# Altium project HAB-Altitude-Dynamics-Control-Card.PrjPcb (part 1 of 4)
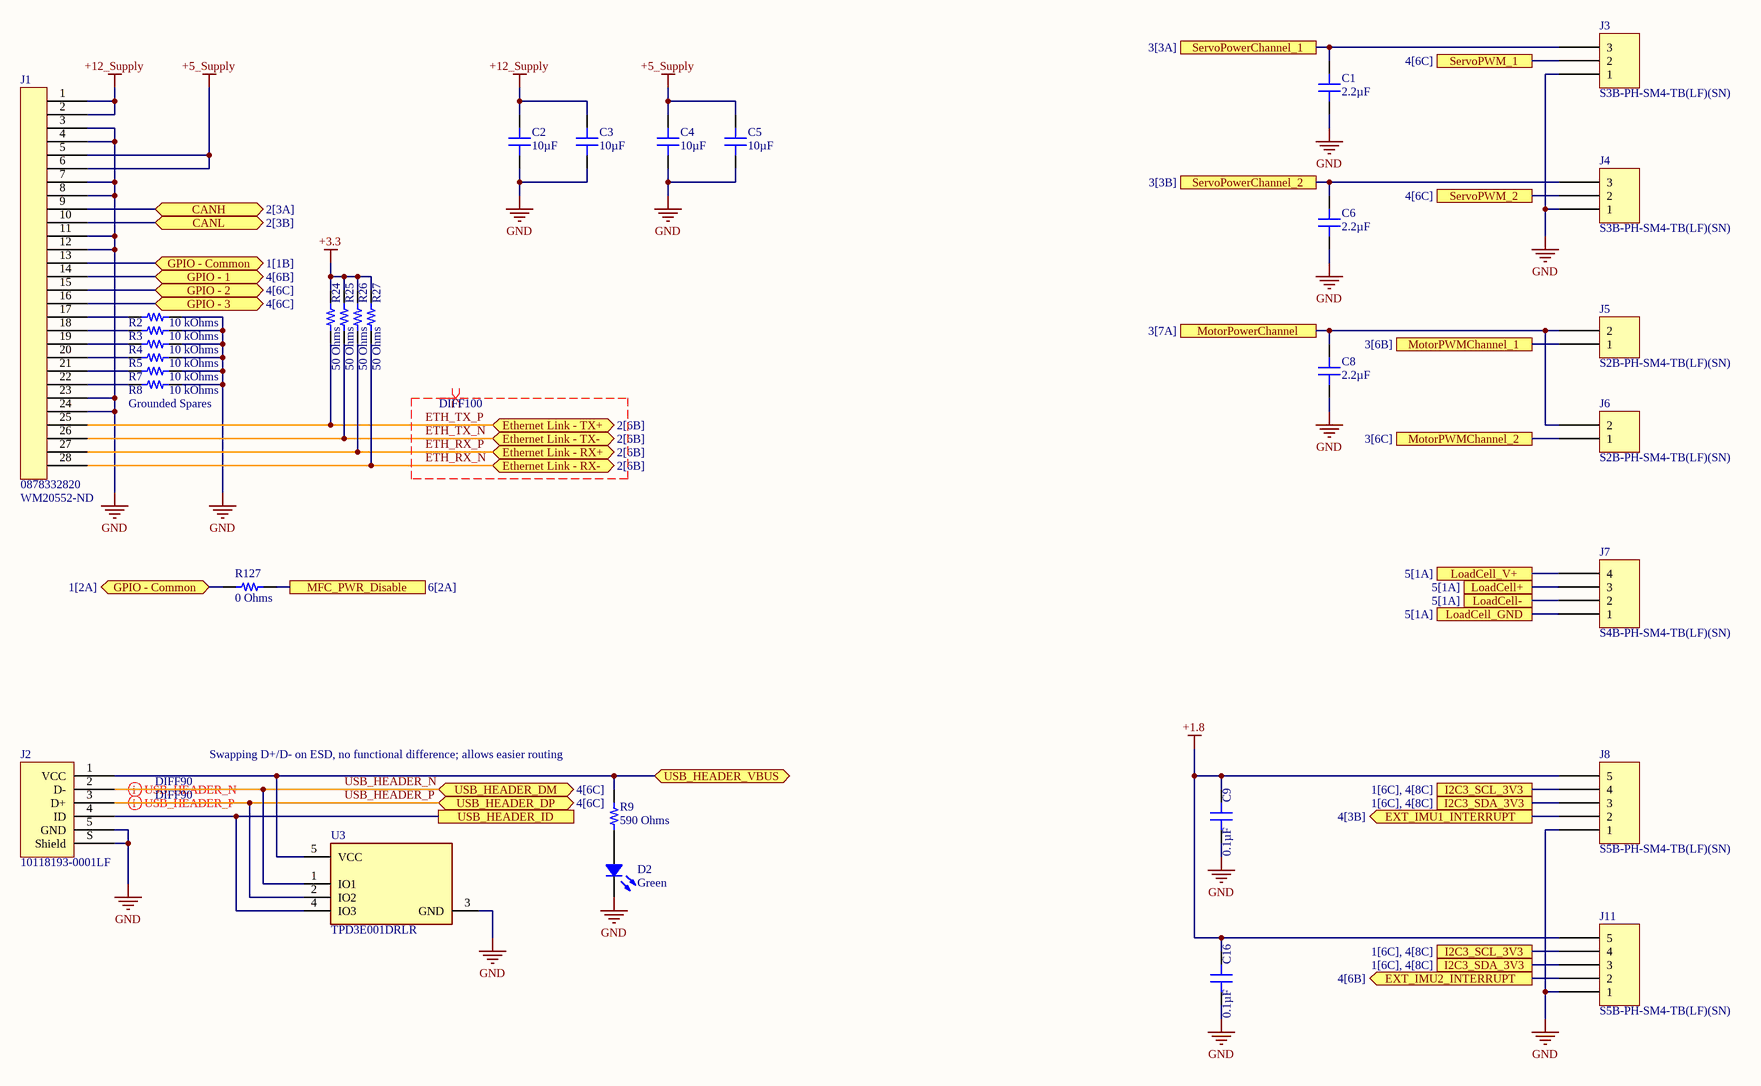
[diagram p0: Interfaces.SchDoc]
7 sheets, 279 parts. Net scope: flat (ports and power ports of the same name join across sheets).
Board file: AltitudeDynamicsControlBoard.PcbDoc
Sheets:
  Interfaces.SchDoc
  Transceivers.SchDoc
  Controllers.SchDoc
  Microcontroller.SchDoc
  Sensors.SchDoc
  Power-Supplies.SchDoc
  12V-Power-Supplies.SchDoc

## Sheet Interfaces.SchDoc: Payload Card Interfaces
size A3; Revision: 1A; SheetNumber: 1; SheetTotal: 7; Organization: Brickworks; Address1: Matthew Glazer; Address2: Design Engineer

### Parts
C1  2.2µF  [CAP 0603_1608]
C2  10µF  [CAP 0805_2012]
C3  10µF  [CAP 0805_2012]
C4  10µF  [CAP 0805_2012]
C5  10µF  [CAP 0805_2012]
C6  2.2µF  [CAP 0603_1608]
C8  2.2µF  [CAP 0603_1608]
C9  0.1µF  [CAP 0603_1608]
C16  0.1µF  [CAP 0603_1608]
D2  Green  [LED 0603_1608 GREEN]
J1  0878332820  Supplier Part Number 1: WM20552-ND  [0878332820]
J2  10118193-0001LF  [FCI USB 10118193-0001LF]
J3  S3B-PH-SM4-TB(LF)(SN)  [JST S3B-PH-SM4-TB]
J4  S3B-PH-SM4-TB(LF)(SN)  [JST S3B-PH-SM4-TB]
J5  S2B-PH-SM4-TB(LF)(SN)  [JST S2B-PH-SM4-TB]
J6  S2B-PH-SM4-TB(LF)(SN)  [JST S2B-PH-SM4-TB]
J7  S4B-PH-SM4-TB(LF)(SN)  [JST S4B-PH-SM4-TB]
J8  S5B-PH-SM4-TB(LF)(SN)  [JST S5B-PH-SM4-TB]
J11  S5B-PH-SM4-TB(LF)(SN)  [JST S5B-PH-SM4-TB]
R2  10 kOhms  [RES 0603_1608]
R3  10 kOhms  [RES 0603_1608]
R4  10 kOhms  [RES 0603_1608]
R5  10 kOhms  [RES 0603_1608]
R7  10 kOhms  [RES 0603_1608]
R8  10 kOhms  [RES 0603_1608]
R9  590 Ohms  [RES 0603_1608]
R24  50 Ohms  [RES 0603_1608]
R25  50 Ohms  [RES 0603_1608]
R26  50 Ohms  [RES 0603_1608]
R27  50 Ohms  [RES 0603_1608]
R127  0 Ohms  [RES 0603_1608]
U3  TPD3E001DRLR  [FP-DRL0005A-MFG]

### Ports
CANH (bidir, see 2[3A]), CANL (bidir, see 2[3B]), Ethernet Link - RX+ (bidir, see 2[6B]), Ethernet Link - RX- (bidir, see 2[6B]), Ethernet Link - TX+ (bidir, see 2[6B]), Ethernet Link - TX- (bidir, see 2[6B]), EXT_IMU1_INTERRUPT (out, see 4[3B]), EXT_IMU2_INTERRUPT (out, see 4[6B]), GPIO - 1 (bidir, see 4[6B]), GPIO - 2 (bidir, see 4[6C]), GPIO - 3 (bidir, see 4[6C]), GPIO - Common (bidir, see 1[1B]), GPIO - Common (bidir, see 1[2A]), I2C3_SCL_3V3 (see 1[6C], 4[8C]), I2C3_SDA_3V3 (see 1[6C], 4[8C]), LoadCell+ (see 5[1A]), LoadCell- (see 5[1A]), LoadCell_GND (see 5[1A]), LoadCell_V+ (see 5[1A]), MFC_PWR_Disable (see 6[2A]), MotorPowerChannel (see 3[7A]), MotorPWMChannel_1 (see 3[6B]), MotorPWMChannel_2 (see 3[6C]), ServoPowerChannel_1 (see 3[3A]), ServoPowerChannel_2 (see 3[3B]), ServoPWM_1 (see 4[6C]), ServoPWM_2 (see 4[6C]), USB_HEADER_DM (bidir, see 4[6C]), USB_HEADER_DP (bidir, see 4[6C]), USB_HEADER_ID, USB_HEADER_VBUS (bidir)

### Nets
+1.8: C9.2 C16.2 J8.5 J11.5
+3.3: J7.4 R24.2 R25.2 R26.2 R27.2 ; port LoadCell_V+
+5_Supply: C4.2 C5.2 J1.5 J1.6
+12_Supply: C2.2 C3.2 J1.1 J1.2
GND: C1.1 C2.1 C3.1 C4.1 C5.1 C6.1 C8.1 C9.1 C16.1 D2.2 J1.3 J1.4 J1.7 J1.8 J1.11 J1.12 J1.23 J1.24 J2.5(GND) J2.S(Shield) J3.1 J4.1 J8.1 J11.1 R2.2 R3.2 R4.2 R5.2 R7.2 R8.2 U3.3(GND)
ETH_RX_N: J1.28 R27.1 ; port Ethernet Link - RX-
ETH_RX_P: J1.27 R26.1 ; port Ethernet Link - RX+
ETH_TX_N: J1.26 R25.1 ; port Ethernet Link - TX-
ETH_TX_P: J1.25 R24.1 ; port Ethernet Link - TX+
USB_HEADER_N: J2.2(D-) U3.1(IO1) ; port USB_HEADER_DM
USB_HEADER_P: J2.3(D+) U3.2(IO2) ; port USB_HEADER_DP
NetC1_2: C1.2 J3.3 ; port ServoPowerChannel_1
NetC6_2: C6.2 J4.3 ; port ServoPowerChannel_2
NetC8_2: C8.2 J5.2 J6.2 ; port MotorPowerChannel
NetD1_1: R127.2 ; port MFC_PWR_Disable
NetD2_1: D2.1 R9.1
NetD4_1: J1.10 ; port CANL
NetD4_2: J1.9 ; port CANH
NetJ1_13: J1.13 R127.1 ; port GPIO - Common
NetJ1_14: J1.14 ; port GPIO - 1
NetJ1_15: J1.15 ; port GPIO - 2
NetJ1_16: J1.16 ; port GPIO - 3
NetJ1_17: J1.17 R2.1
NetJ1_18: J1.18 R3.1
NetJ1_19: J1.19 R4.1
NetJ1_20: J1.20 R5.1
NetJ1_21: J1.21 R7.1
NetJ1_22: J1.22 R8.1
NetJ2_1: J2.1(VCC) R9.2 U3.5(VCC) ; port USB_HEADER_VBUS
NetJ2_4: J2.4(ID) U3.4(IO3) ; port USB_HEADER_ID
NetJ3_2: J3.2 ; port ServoPWM_1
NetJ4_2: J4.2 ; port ServoPWM_2
NetJ5_1: J5.1 ; port MotorPWMChannel_1
NetJ6_1: J6.1 ; port MotorPWMChannel_2
NetJ7_1: J7.1 ; port LoadCell_GND
NetJ7_2: J7.2 ; port LoadCell-
NetJ7_3: J7.3 ; port LoadCell+
NetJ8_2: J8.2 ; port EXT_IMU1_INTERRUPT
NetJ8_3: J8.3 J11.3 ; port I2C3_SDA_3V3
NetJ8_4: J8.4 J11.4 ; port I2C3_SCL_3V3
NetJ11_2: J11.2 ; port EXT_IMU2_INTERRUPT

### Layout directives
differential pair; differential pair class DIFF90: USB_HEADER_N, USB_HEADER_P
differential pair; differential pair class DIFF100: ETH_RX_N, ETH_RX_P, ETH_TX_N, ETH_TX_P

### Notes on the sheet
- (near R8) Grounded Spares
- (near R9) Swapping D+/D- on ESD, no functional difference; allows easier routing
- Title
- Size:
- Date:
- A3
- Number:
- Time:
- Revision:
- Sheet
- of
- File:

### Library data of the parts
C1 C6 C8 = EMK107BJ225KA-T: CAP CER 2.2UF 16V X5R 0603; Manufacturer: Taiyo Yuden; Tolerance: ±10%; Part Number: EMK107BJ225KA-T; Value: 2.2µF; Applications: General Purpose; Capacitance: 2.2µF; ComponentLink1Description: Datasheet; ComponentLink1URL: https://ds.yuden.co.jp/TYCOMPAS/ut/detail?pn=EMK107BJ225KA-T  &u=M; ComponentLink2Description: DigiKey Link; ComponentLink2URL: http://digikey.com/product-detail/en/taiyo-yuden/EMK107BJ225KA-T/587-1430-1-ND/1004061; Device Package: 0603 (1608 Metric); LastUpdated: 9/2/2020 1:03:30 AM; Lifecycle Status: Active; Minimum Order: 1; Mounting Type: Surface Mount, MLCC; Operating Temperature: -55°C ~ 85°C; Package / Case: 0603 (1608 Metric); Packaging: TapeAndReel; PartId: 5619; Part Status: Active; Price: 0.02; Series: M; Size / Dimension: 0.063" L x 0.031" W (1.60mm x 0.80mm); Supplier 1: DigiKey; Supplier Part Number 1: 587-1430-1-ND; Temperature Coefficient: X5R; Thickness (Max): 0.035" (0.90mm); Voltage - Rated: 16V
C2-C5 = CC0805KKX5R7BB106: CAP CER 10UF 16V X5R 0805; Manufacturer: Yageo; Tolerance: ±10%; Part Number: CC0805KKX5R7BB106; Value: 10µF; Applications: General Purpose; Capacitance: 10µF; ComponentLink1Description: Datasheet; ComponentLink1URL: https://www.yageo.com/upload/media/product/productsearch/datasheet/mlcc/UPY-GPHC_X5R_4V-to-50V_25.pdf; ComponentLink2Description: DigiKey Link; ComponentLink2URL: http://digikey.com/product-detail/en/yageo/CC0805KKX5R7BB106/311-1865-1-ND/5195767; Device Package: 0805 (2012 Metric); LastUpdated: 9/2/2020 1:04:30 AM; Lifecycle Status: Active; Minimum Order: 1; Mounting Type: Surface Mount, MLCC; Operating Temperature: -55°C ~ 85°C; Package / Case: 0805 (2012 Metric); Packaging: TapeAndReel; PartId: 8867; Part Status: Active; Price: 0.09; Series: CC; Size / Dimension: 0.079" L x 0.049" W (2.00mm x 1.25mm); Supplier 1: DigiKey; Supplier Part Number 1: 311-1865-1-ND; Temperature Coefficient: X5R; Thickness (Max): 0.057" (1.45mm); Voltage - Rated: 16V
C9 C16 = CL10B104KA8WPNC: CAP CER 0.1UF 25V X7R 0603; Manufacturer: Samsung Electro-Mechanics; Tolerance: ±10%; Part Number: CL10B104KA8WPNC; Value: 0.1µF; Applications: Automotive; Capacitance: 0.1µF; ComponentLink1Description: Datasheet; ComponentLink1URL: http://www.samsungsem.com/kr/support/product-search/mlcc/CL10B104KA8WPNC.jsp; ComponentLink2Description: DigiKey Link; ComponentLink2URL: http://digikey.com/product-detail/en/samsung-electro-mechanics/CL10B104KA8WPNC/1276-6717-1-ND/5961576; Device Package: 0603 (1608 Metric); Features: Open Mode; LastUpdated: 9/2/2020 1:03:30 AM; Lifecycle Status: Active; Minimum Order: 1; Mounting Type: Surface Mount, MLCC; Operating Temperature: -55°C ~ 125°C; Package / Case: 0603 (1608 Metric); Packaging: TapeAndReel; PartId: 5631; Part Status: Active; Price: 0.02; Ratings: AEC-Q200; Series: CL; Size / Dimension: 0.063" L x 0.031" W (1.60mm x 0.80mm); Supplier 1: DigiKey; Supplier Part Number 1: 1276-6717-1-ND; Temperature Coefficient: X7R; Thickness (Max): 0.035" (0.90mm); Voltage - Rated: 25V
D2 = LTST-C193KGKT-5A: LED GREEN CLEAR CHIP SMD; Manufacturer: Lite-On Inc.; Configuration: Standard; Current - Test: 5mA; Lens Color: Colorless; Lens Size: 1.15mm x 0.80mm; Lens Style: Rectangle with Flat Top; Millicandela Rating: 16.25mcd; Viewing Angle: 130°; Voltage - Forward (Vf) (Typ): 2V; Wavelength - Dominant: 572nm; Wavelength - Peak: 574nm; Part Number: LTST-C193KGKT-5A; Color: Green; ComponentLink1Description: Datasheet; ComponentLink1URL: http://optoelectronics.liteon.com/upload/download/DS22-2007-0094/LTST-C193KGKT-5A.PDF; ComponentLink2Description: DigiKey Link; ComponentLink2URL: http://digikey.com/product-detail/en/lite-on-inc/LTST-C193KGKT-5A/160-1828-1-ND/2356247; Device Package: 0603 (1608 Metric); Height (Max): 0.45mm; LastUpdated: 9/2/2020 1:20:41 AM; Lens Transparency: Clear; Lifecycle Status: Active; Minimum Order: 1; Mounting Type: Surface Mount; Package / Case: 0603 (1608 Metric); Packaging: TapeAndReel; PartId: 694; Part Status: Active; Price: 0.06; Series: -; Size / Dimension: 1.60mm L x 0.80mm W; Supplier 1: DigiKey; Supplier Part Number 1: 160-1828-1-ND; Supplier Device Package: Chip LED; Value: Green
J2 = 10118193-0001LF: CONN RCPT USB2.0 MICRO B SMD R/A; Manufacturer: Amphenol ICC (FCI); Connector Type: USB - micro B; Current Rating (Amps): 1.8A per Contact; Gender: Receptacle; Mating Cycles: 10000; Number of Contacts: 5; Number of Ports: 1; Shielding: Shielded; Voltage - Rated: 100VAC; Part Number: 10118193-0001LF; ComponentLink1Description: Datasheet; ComponentLink1URL: https://cdn.amphenol-icc.com/media/wysiwyg/files/documentation/datasheet/inputoutput/io_usb_micro.pdf; ComponentLink2Description: DigiKey Link; ComponentLink2URL: //digikey.com/product-detail/en/amphenol-icc-fci/10118193-0001LF/609-4616-2-ND/2785388; Features: Solder Retention; LastUpdated: 12/9/2019 8:51:28 PM; Lifecycle Status: 0; Minimum Order: 1; Mounting Feature: Horizontal; Mounting Type: Surface Mount, Right Angle; Through Hole; Operating Temperature: -30°C ~ 80°C; Packaging: TapeAndReel; Part Status: Active; Price: 0.21; Series: -; Specifications: USB 2.0; Supplier 1: DigiKey; Supplier Part Number 1: 609-4616-2-ND; Termination: Solder
J3 J4 = S3B-PH-SM4-TB(LF)(SN): CONN HEADER SMD R/A 3POS 2MM; Manufacturer: JST Sales America Inc.; Contact Length - Mating: 0.130" (3.30mm); Current Rating (Amps): 2A; Material Flammability Rating: UL94 V-0; Number of Positions: 3; Number of Positions Loaded: All; Pitch - Mating: 0.079" (2.00mm); Shrouding: Shrouded - 4 Wall; Style: Board to Cable/Wire; Voltage Rating: 100V; Part Number: S3B-PH-SM4-TB(LF)(SN); ComponentLink1Description: Datasheet; ComponentLink1URL: http://www.jst-mfg.com/product/pdf/eng/ePH.pdf; ComponentLink2Description: DigiKey Link; ComponentLink2URL: http://digikey.com/product-detail/en/jst-sales-america-inc/S3B-PH-SM4-TB-LF-SN/455-1750-1-ND/926847; Connector Type: Header; Contact Finish - Mating: Tin; Contact Finish - Post: Tin; Contact Material: Copper Alloy; Contact Shape: Square; Contact Type: Male Pin; Fastening Type: Detent Lock; Features: Solder Retention; Insulation Color: Natural; Insulation Height: 0.217" (5.51mm); Insulation Material: Polyamide (PA6T), Nylon 6T; LastUpdated: 1/15/2020 3:45:23 AM; Lifecycle Status: Active; Minimum Order: 1; Mounting Type: Surface Mount, Right Angle; Number of Rows: 1; Operating Temperature: -25°C ~ 85°C; Packaging: TapeAndReel; PartId: 116; Part Status: Active; Price: 0.32; Series: PH; Supplier 1: DigiKey; Supplier Part Number 1: 455-1750-1-ND; Termination: Solder
J5 J6 = S2B-PH-SM4-TB(LF)(SN): CONN HEADER SMD R/A 2POS 2MM; Manufacturer: JST Sales America Inc.; Contact Length - Mating: 0.130" (3.30mm); Current Rating (Amps): 2A; Material Flammability Rating: UL94 V-0; Number of Positions: 2; Number of Positions Loaded: All; Pitch - Mating: 0.079" (2.00mm); Shrouding: Shrouded - 4 Wall; Style: Board to Cable/Wire; Voltage Rating: 100V; Part Number: S2B-PH-SM4-TB(LF)(SN); ComponentLink1Description: Datasheet; ComponentLink1URL: http://www.jst-mfg.com/product/pdf/eng/ePH.pdf; ComponentLink2Description: DigiKey Link; ComponentLink2URL: http://digikey.com/product-detail/en/jst-sales-america-inc/S2B-PH-SM4-TB-LF-SN/455-1749-1-ND/926846; Connector Type: Header; Contact Finish - Mating: Tin; Contact Finish - Post: Tin; Contact Material: Copper Alloy; Contact Shape: Square; Contact Type: Male Pin; Fastening Type: Detent Lock; Features: Solder Retention; Insulation Color: Natural; Insulation Height: 0.217" (5.51mm); Insulation Material: Polyamide (PA6T), Nylon 6T; LastUpdated: 1/15/2020 3:45:11 AM; Lifecycle Status: Active; Minimum Order: 1; Mounting Type: Surface Mount, Right Angle; Number of Rows: 1; Operating Temperature: -25°C ~ 85°C; Packaging: TapeAndReel; PartId: 115; Part Status: Active; Price: 0.27; Series: PH; Supplier 1: DigiKey; Supplier Part Number 1: 455-1749-1-ND; Termination: Solder
J7 = S4B-PH-SM4-TB(LF)(SN): CONN HEADER SMD R/A 4POS 2MM; Manufacturer: JST Sales America Inc.; Contact Length - Mating: 0.130" (3.30mm); Current Rating (Amps): 2A; Material Flammability Rating: UL94 V-0; Number of Positions: 4; Number of Positions Loaded: All; Pitch - Mating: 0.079" (2.00mm); Shrouding: Shrouded - 4 Wall; Style: Board to Cable/Wire; Voltage Rating: 100V; Part Number: S4B-PH-SM4-TB(LF)(SN); ComponentLink1Description: Datasheet; ComponentLink1URL: http://www.jst-mfg.com/product/pdf/eng/ePH.pdf; ComponentLink2Description: DigiKey Link; ComponentLink2URL: http://digikey.com/product-detail/en/jst-sales-america-inc/S4B-PH-SM4-TB-LF-SN/455-1751-1-ND/926848; Connector Type: Header; Contact Finish - Mating: Tin; Contact Finish - Post: Tin; Contact Material: Copper Alloy; Contact Shape: Square; Contact Type: Male Pin; Fastening Type: Detent Lock; Features: Solder Retention; Insulation Color: Natural; Insulation Height: 0.217" (5.51mm); Insulation Material: Polyamide (PA6T), Nylon 6T; LastUpdated: 1/15/2020 3:45:33 AM; Lifecycle Status: Active; Minimum Order: 1; Mounting Type: Surface Mount, Right Angle; Number of Rows: 1; Operating Temperature: -25°C ~ 85°C; Packaging: TapeAndReel; PartId: 117; Part Status: Active; Price: 0.37; Series: PH; Supplier 1: DigiKey; Supplier Part Number 1: 455-1751-1-ND; Termination: Solder
J8 J11 = S5B-PH-SM4-TB(LF)(SN): CONN HEADER SMD R/A 5POS 2MM; Manufacturer: JST Sales America Inc.; Contact Length - Mating: 0.130" (3.30mm); Current Rating (Amps): 2A; Material Flammability Rating: UL94 V-0; Number of Positions: 5; Number of Positions Loaded: All; Pitch - Mating: 0.079" (2.00mm); Shrouding: Shrouded - 4 Wall; Style: Board to Cable/Wire; Voltage Rating: 100V; Part Number: S5B-PH-SM4-TB(LF)(SN); ComponentLink1Description: Datasheet; ComponentLink1URL: http://www.jst-mfg.com/product/pdf/eng/ePH.pdf; ComponentLink2Description: DigiKey Link; ComponentLink2URL: http://digikey.com/product-detail/en/jst-sales-america-inc/S5B-PH-SM4-TB-LF-SN/455-1752-1-ND/926849; Connector Type: Header; Contact Finish - Mating: Tin; Contact Finish - Post: Tin; Contact Material: Copper Alloy; Contact Shape: Square; Contact Type: Male Pin; Fastening Type: Detent Lock; Features: Solder Retention; Insulation Color: Natural; Insulation Height: 0.217" (5.51mm); Insulation Material: Polyamide (PA6T), Nylon 6T; LastUpdated: 1/15/2020 3:45:44 AM; Lifecycle Status: Active; Minimum Order: 1; Mounting Type: Surface Mount, Right Angle; Number of Rows: 1; Operating Temperature: -25°C ~ 85°C; Packaging: TapeAndReel; PartId: 118; Part Status: Active; Price: 0.39; Series: PH; Supplier 1: DigiKey; Supplier Part Number 1: 455-1752-1-ND; Termination: Solder
R2-R5 R7 R8 = RMCF0603JT10K0: RES 10K OHM 5% 1/10W 0603; Manufacturer: Stackpole Electronics Inc; Power (Watts): 0.1W, 1/10W; Temperature Coefficient: ±200ppm/°C; Part Number: RMCF0603JT10K0; Value: 10 kOhms; ComponentLink1Description: Datasheet; ComponentLink1URL: https://www.seielect.com/catalog/sei-packaging.pdf; ComponentLink2Description: DigiKey Link; ComponentLink2URL: http://digikey.com/product-detail/en/stackpole-electronics-inc/RMCF0603JT10K0/RMCF0603JT10K0CT-ND/1943191; Composition: Thick Film; Device Package: 0603 (1608 Metric); Features: Automotive AEC-Q200; Height - Seated (Max): 0.022" (0.55mm); LastUpdated: 8/30/2020 8:48:45 PM; Lifecycle Status: Active; Minimum Order: 1; Number of Terminations: 2; Operating Temperature: -55°C ~ 155°C; Package / Case: 0603 (1608 Metric); Packaging: CutTape; PartId: 25659; Part Status: Active; Price: 0.10; Ratings: AEC-Q200; Resistance: 10 kOhms; Series: RMCF; Size / Dimension: 0.061" L x 0.031" W (1.55mm x 0.80mm); Supplier 1: DigiKey; Supplier Part Number 1: RMCF0603JT10K0CT-ND; Supplier Device Package: 0603; Tolerance: ±5%
R9 = RMCF0603FT590R: RES 590 OHM 1% 1/10W 0603; Manufacturer: Stackpole Electronics Inc; Power (Watts): 0.1W, 1/10W; Temperature Coefficient: ±100ppm/°C; Part Number: RMCF0603FT590R; Value: 590 Ohms; ComponentLink1Description: Datasheet; ComponentLink1URL: https://www.seielect.com/catalog/sei-rmcf_rmcp.pdf; ComponentLink2Description: DigiKey Link; ComponentLink2URL: http://digikey.com/product-detail/en/stackpole-electronics-inc/RMCF0603FT590R/RMCF0603FT590RCT-ND/2418096; Composition: Thick Film; Device Package: 0603 (1608 Metric); Features: Automotive AEC-Q200; Height - Seated (Max): 0.022" (0.55mm); LastUpdated: 9/2/2020 1:09:40 AM; Lifecycle Status: Active; Minimum Order: 1; Number of Terminations: 2; Operating Temperature: -55°C ~ 155°C; Package / Case: 0603 (1608 Metric); Packaging: CutTape; PartId: 23847; Part Status: Active; Price: 0.10; Ratings: AEC-Q200; Resistance: 590 Ohms; Series: RMCF; Size / Dimension: 0.061" L x 0.031" W (1.55mm x 0.80mm); Supplier 1: DigiKey; Supplier Part Number 1: RMCF0603FT590RCT-ND; Supplier Device Package: 0603; Tolerance: ±1%
R24-R27 = CRCW060350R0FKEA: RES SMD 50 OHM 1% 1/10W 0603; Manufacturer: Vishay Dale; Power (Watts): 0.1W, 1/10W; Temperature Coefficient: ±100ppm/°C; Part Number: CRCW060350R0FKEA; Value: 50 Ohms; ComponentLink1Description: Datasheet; ComponentLink1URL: http://www.vishay.com/docs/20035/dcrcwe3.pdf; ComponentLink2Description: DigiKey Link; ComponentLink2URL: http://digikey.com/product-detail/en/vishay-dale/CRCW060350R0FKEA/541-3318-1-ND/6684924; Composition: Thick Film; Device Package: 0603 (1608 Metric); Features: Automotive AEC-Q200; Height - Seated (Max): 0.020" (0.50mm); LastUpdated: 9/2/2020 1:09:40 AM; Lifecycle Status: Active; Minimum Order: 1; Number of Terminations: 2; Operating Temperature: -55°C ~ 155°C; Package / Case: 0603 (1608 Metric); Packaging: CutTape; PartId: 23780; Part Status: Active; Price: 0.10; Ratings: AEC-Q200; Resistance: 50 Ohms; Series: CRCW; Size / Dimension: 0.061" L x 0.033" W (1.55mm x 0.85mm); Supplier 1: DigiKey; Supplier Part Number 1: 541-3318-1-ND; Supplier Device Package: 0603; Tolerance: ±1%
R127 = RMCF0603ZT0R00: RES 0 OHM JUMPER 1/10W 0603; Manufacturer: Stackpole Electronics Inc; Power (Watts): 0.1W, 1/10W; Part Number: RMCF0603ZT0R00; Value: 0 Ohms; ComponentLink1Description: Datasheet; ComponentLink1URL: https://www.seielect.com/catalog/sei-rmcf_rmcp.pdf; ComponentLink2Description: DigiKey Link; ComponentLink2URL: http://digikey.com/product-detail/en/stackpole-electronics-inc/RMCF0603ZT0R00/RMCF0603ZT0R00CT-ND/1943218; Composition: Thick Film; Device Package: 0603 (1608 Metric); Features: Automotive AEC-Q200; Height - Seated (Max): 0.022" (0.55mm); LastUpdated: 9/2/2020 1:09:45 AM; Lifecycle Status: Active; Minimum Order: 1; Number of Terminations: 2; Operating Temperature: -55°C ~ 155°C; Package / Case: 0603 (1608 Metric); Packaging: CutTape; PartId: 22613; Part Status: Active; Price: 0.10; Ratings: AEC-Q200; Resistance: 0 Ohms; Series: RMCF; Size / Dimension: 0.061" L x 0.031" W (1.55mm x 0.80mm); Supplier 1: DigiKey; Supplier Part Number 1: RMCF0603ZT0R00CT-ND; Supplier Device Package: 0603; Tolerance: Jumper
U3 = CMP-0326-00052-4: TVS DIODE 5.5V SOT5; Min Supply Voltage: 900mV; Number of Bidirectional Channels: 3; Peak Pulse Power: 90W; Direction: Unidirectional; Leakage Current: 1nA; Interface: USB; Max Supply Current: 100nA; Capacitance: 1.5pF; Breakdown Voltage: 11V; Clamping Voltage: 105.5V; Power Line Protection: Yes; Packaging: Tape and Reel; Length: 1.6mm; REACH SVHC: No SVHC; Min Operating Temperature: -40°C; Lead Free: Lead Free; Max Supply Voltage: 5.5V; RoHS Compliant: Yes; Termination: SMD/SMT; Number of Channels: 3; Max Supply Voltage (DC): 5.5V; Weight: 9.9E-05oz; Package Quantity: 1; Reverse Standoff Voltage: 5.5V; Number of Pins: 5; Case/Package: SOT-553; Max Operating Temperature: 85°C; Nominal Supply Current: 1nA; Width: 1.2mm; Min Breakdown Voltage: 11V; Min Supply Voltage (DC): 900mV; Height: 0.55mm; Radiation Hardening: No; Depth: 1.2mm
J1 = 0878332820: Supplier 1: Digi-Key

## Sheet Transceivers.SchDoc: Payload Card Transceivers
size A3; Revision: 1A; SheetNumber: 2; SheetTotal: 7; Organization: Brickworks; Address1: Matthew Glazer; Address2: Design Engineer
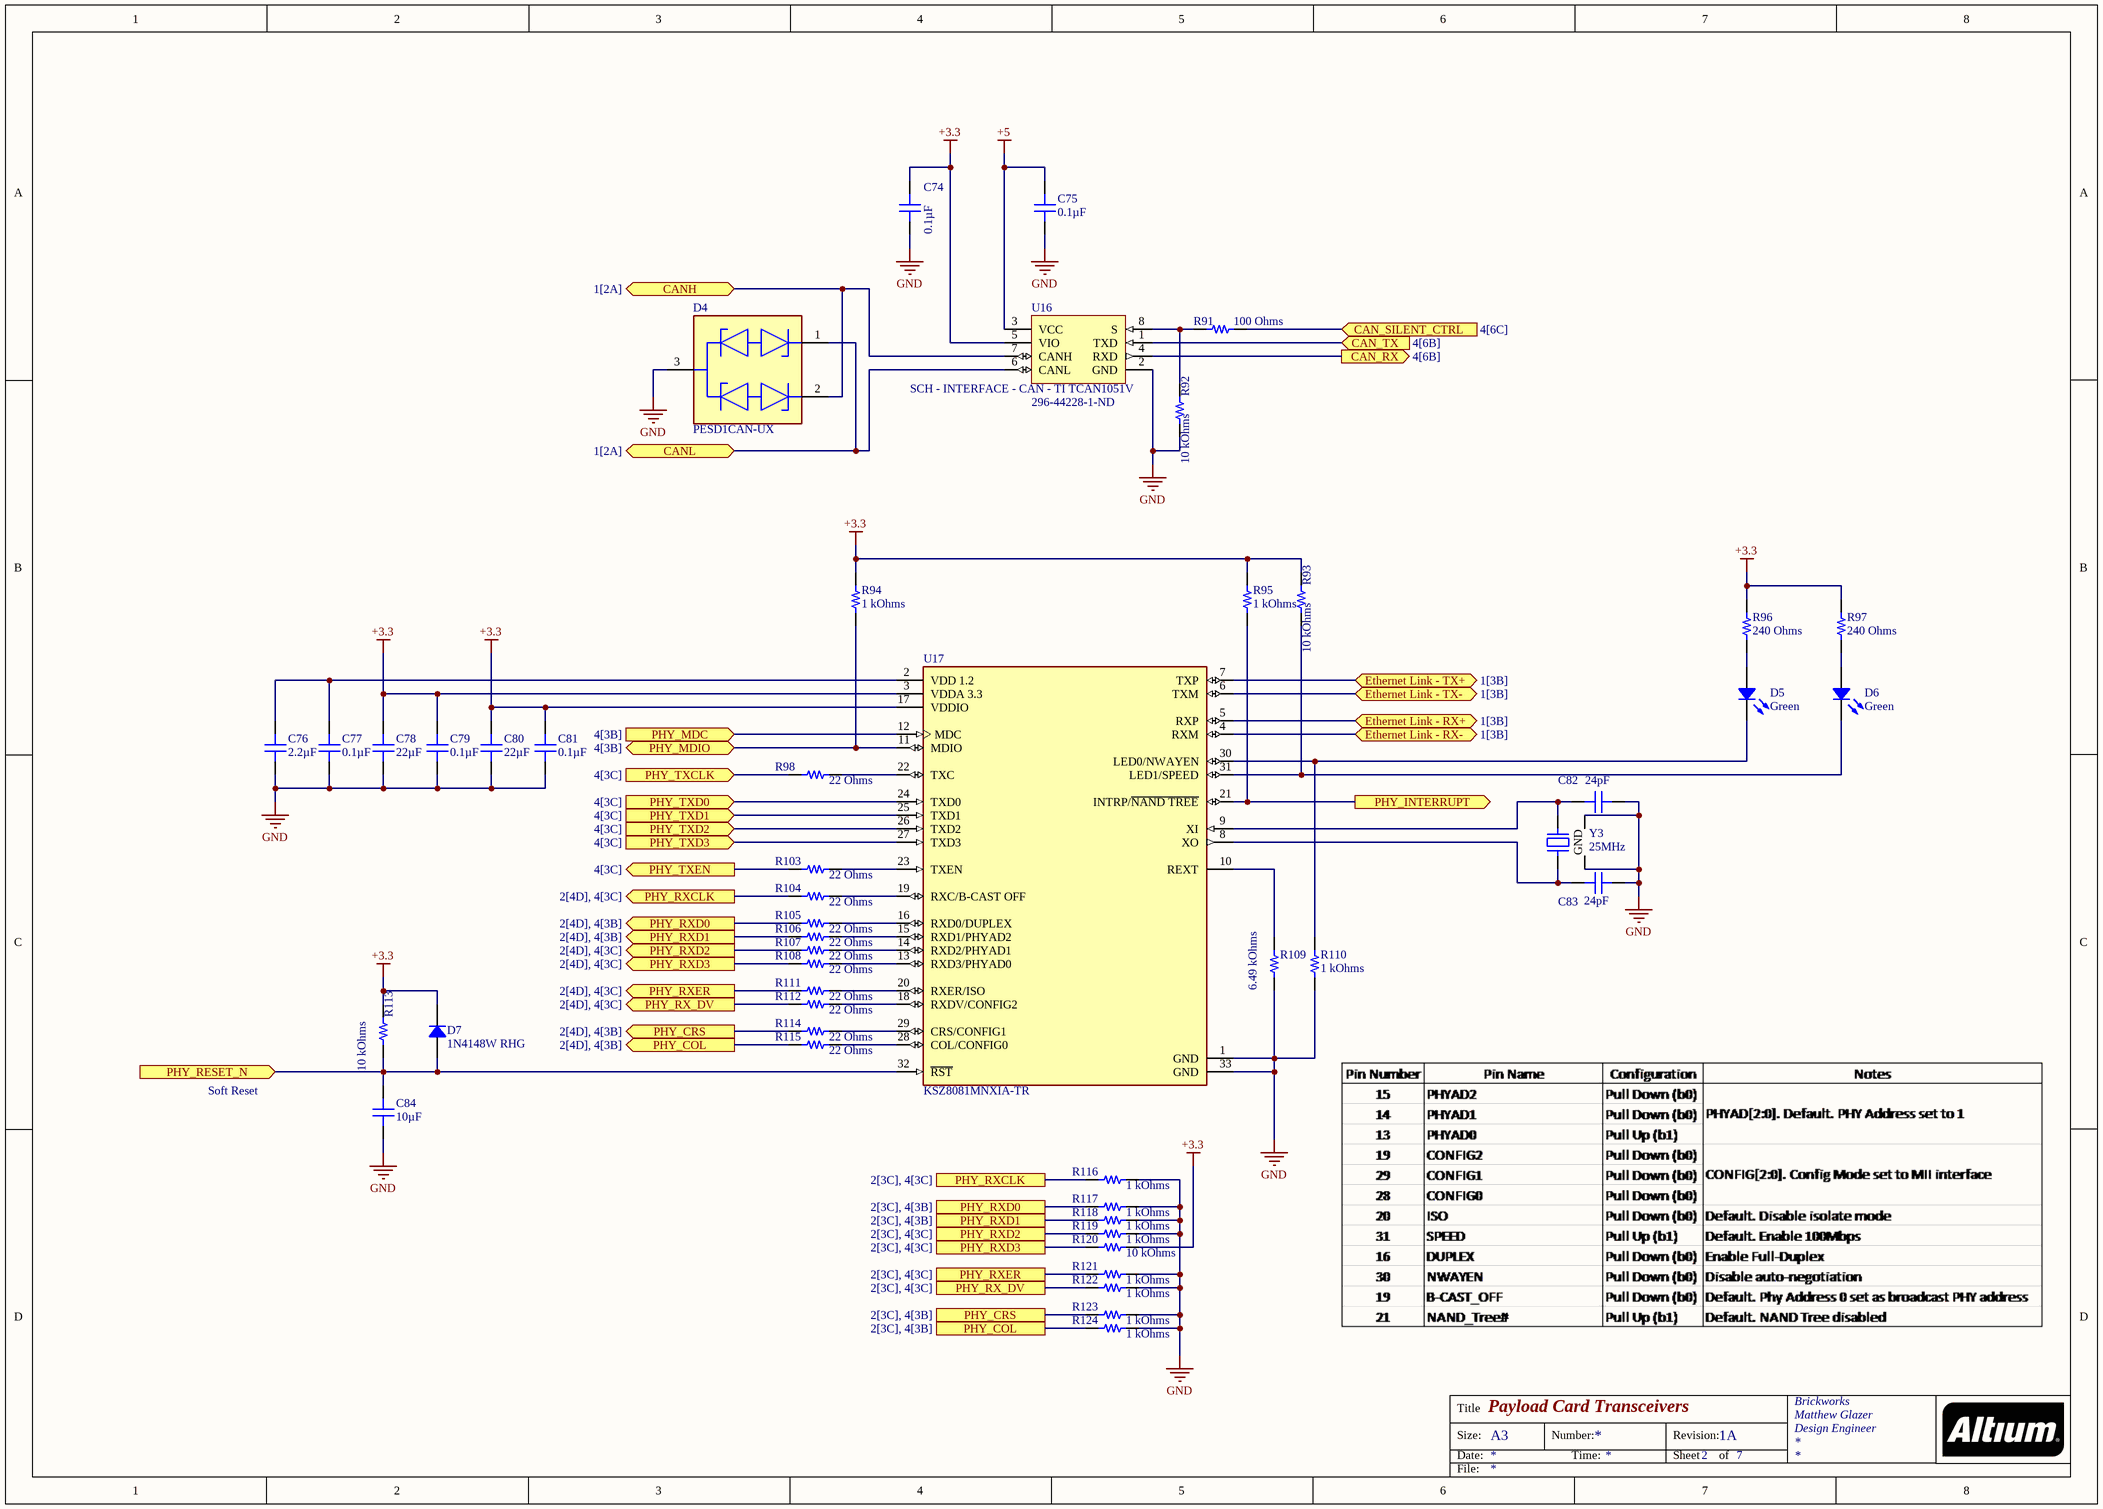
[diagram p1: Transceivers.SchDoc]

### Parts
C74  0.1µF  [CAP 0603_1608]
C75  0.1µF  [CAP 0603_1608]
C76  2.2µF  [CAP 0805_2012]
C77  0.1µF  [CAP 0603_1608]
C78  22µF  [CAP 0805_2012]
C79  0.1µF  [CAP 0603_1608]
C80  22µF  [CAP 0805_2012]
C81  0.1µF  [CAP 0603_1608]
C82  24pF  [CAP 0603_1608]
C83  24pF  [CAP 0603_1608]
C84  10µF  [CAP 0805_2012]
D4  PESD1CAN-UX  [FP-SOT323-MFG]
D5  Green  [LED 0603_1608 GREEN]
D6  Green  [LED 0603_1608 GREEN]
D7  1N4148W RHG  [SOD123F]
R91  100 Ohms  [RES 0603_1608]
R92  10 kOhms  [RES 0603_1608]
R93  10 kOhms  [RES 0603_1608]
R94  1 kOhms  [RES 0603_1608]
R95  1 kOhms  [RES 0603_1608]
R96  240 Ohms  [RES 0603_1608]
R97  240 Ohms  [RES 0603_1608]
R98  22 Ohms  [RES 0603_1608]
R103  22 Ohms  [RES 0603_1608]
R104  22 Ohms  [RES 0603_1608]
R105  22 Ohms  [RES 0603_1608]
R106  22 Ohms  [RES 0603_1608]
R107  22 Ohms  [RES 0603_1608]
R108  22 Ohms  [RES 0603_1608]
R109  6.49 kOhms  [RES 0603_1608]
R110  1 kOhms  [RES 0603_1608]
R111  22 Ohms  [RES 0603_1608]
R112  22 Ohms  [RES 0603_1608]
R113  10 kOhms  [RES 0603_1608]
R114  22 Ohms  [RES 0603_1608]
R115  22 Ohms  [RES 0603_1608]
R116  1 kOhms  [RES 0603_1608]
R117  1 kOhms  [RES 0603_1608]
R118  1 kOhms  [RES 0603_1608]
R119  1 kOhms  [RES 0603_1608]
R120  10 kOhms  [RES 0603_1608]
R121  1 kOhms  [RES 0603_1608]
R122  1 kOhms  [RES 0603_1608]
R123  1 kOhms  [RES 0603_1608]
R124  1 kOhms  [RES 0603_1608]
U16  SCH - INTERFACE - CAN - TI TCAN1051V  Supplier Part Number 1: 296-44228-1-ND  [PCB - LEADS - SOIC - TI SOIC-8]
U17  KSZ8081MNXIA-TR  [FP-QFN55-32LD-PL-5-MFG]
Y3  25MHz  [EPSON TSX-3225]

### Ports
CAN_RX (out, see 4[6B]), CAN_SILENT_CTRL (in, see 4[6C]), CAN_TX (in, see 4[6B]), CANH (bidir, see 1[2A]), CANL (bidir, see 1[2A]), Ethernet Link - RX+ (bidir, see 1[3B]), Ethernet Link - RX- (bidir, see 1[3B]), Ethernet Link - TX+ (bidir, see 1[3B]), Ethernet Link - TX- (bidir, see 1[3B]), PHY_COL (out, see 2[4D], 4[3B]), PHY_COL (see 2[3C], 4[3B]), PHY_CRS (out, see 2[4D], 4[3B]), PHY_CRS (see 2[3C], 4[3B]), PHY_INTERRUPT (out), PHY_MDC (in, see 4[3B]), PHY_MDIO (bidir, see 4[3B]), PHY_RESET_N (in), PHY_RX_DV (out, see 2[4D], 4[3C]), PHY_RX_DV (see 2[3C], 4[3C]), PHY_RXCLK (out, see 2[4D], 4[3C]), PHY_RXCLK (see 2[3C], 4[3C]), PHY_RXD0 (out, see 2[4D], 4[3B]), PHY_RXD0 (see 2[3C], 4[3B]), PHY_RXD1 (out, see 2[4D], 4[3B]), PHY_RXD1 (see 2[3C], 4[3B]), PHY_RXD2 (out, see 2[4D], 4[3C]), PHY_RXD2 (see 2[3C], 4[3C]), PHY_RXD3 (out, see 2[4D], 4[3C]), PHY_RXD3 (see 2[3C], 4[3C]), PHY_RXER (out, see 2[4D], 4[3C]), PHY_RXER (see 2[3C], 4[3C]), PHY_TXCLK (in, see 4[3C]), PHY_TXD0 (in, see 4[3C]), PHY_TXD1 (in, see 4[3C]), PHY_TXD2 (in, see 4[3C]), PHY_TXD3 (in, see 4[3C]), PHY_TXEN (out, see 4[3C])

### Nets
+3.3: C74.2 C78.2 C79.2 C80.2 C81.2 D7.2 R93.2 R94.2 R95.2 R96.2 R97.2 R113.2 R120.1 U16.5(VIO) U17.3(VDDA_3.3) U17.17(VDDIO)
+5: C75.2 U16.3(VCC)
GND: C74.1 C75.1 C76.1 C77.1 C78.1 C79.1 C80.1 C81.1 C82.2 C83.2 C84.1 D4.3(common_cathode) R92.1 R109.1 R110.1 R116.1 R117.1 R118.1 R119.1 R121.1 R122.1 R123.1 R124.1 U16.2(GND) U17.1(GND) U17.33(GND) Y3.2(GND) Y3.4(GND)
ETH_RX_N: U17.4(RXM) ; port Ethernet Link - RX-
ETH_RX_P: U17.5(RXP) ; port Ethernet Link - RX+
ETH_TX_N: U17.6(TXM) ; port Ethernet Link - TX-
ETH_TX_P: U17.7(TXP) ; port Ethernet Link - TX+
NetC76_2: C76.2 C77.2 U17.2(VDD_1.2)
NetC82_1: C82.1 U17.9(XI) Y3.3
NetC83_1: C83.1 U17.8(XO) Y3.1
NetC84_2: C84.2 D7.1 R113.1 U17.32(~{RST}) ; port PHY_RESET_N
NetD4_1: D4.1(cathode_1) U16.6(CANL) ; port CANL
NetD4_2: D4.2(cathode_2) U16.7(CANH) ; port CANH
NetD5_1: D5.1 R96.1
NetD5_2: D5.2 R110.2 U17.30(LED0/NWAYEN)
NetD6_1: D6.1 R97.1
NetD6_2: D6.2 R93.1 U17.31(LED1/SPEED)
NetR91_1: R91.1 R92.2 U16.8(S)
NetR91_2: R91.2 ; port CAN_SILENT_CTRL
NetR94_1: R94.1 U17.11(MDIO) ; port PHY_MDIO
NetR95_1: R95.1 U17.21(INTRP/~{NAND_TREE}) ; port PHY_INTERRUPT
NetR98_1: R98.1 ; port PHY_TXCLK
NetR98_2: R98.2 U17.22(TXC)
NetR99_1: U17.24(TXD0) ; port PHY_TXD0
NetR100_1: U17.25(TXD1) ; port PHY_TXD1
NetR101_1: U17.26(TXD2) ; port PHY_TXD2
NetR102_1: U17.27(TXD3) ; port PHY_TXD3
NetR103_1: R103.1 ; port PHY_TXEN
NetR103_2: R103.2 U17.23(TXEN)
NetR104_1: R104.1 R116.2 ; port PHY_RXCLK
NetR104_2: R104.2 U17.19(RXC/B-CAST_OFF)
NetR105_1: R105.1 R117.2 ; port PHY_RXD0
NetR105_2: R105.2 U17.16(RXD0/DUPLEX)
NetR106_1: R106.1 R118.2 ; port PHY_RXD1
NetR106_2: R106.2 U17.15(RXD1/PHYAD2)
NetR107_1: R107.1 R119.2 ; port PHY_RXD2
NetR107_2: R107.2 U17.14(RXD2/PHYAD1)
NetR108_1: R108.1 R120.2 ; port PHY_RXD3
NetR108_2: R108.2 U17.13(RXD3/PHYAD0)
NetR109_2: R109.2 U17.10(REXT)
NetR111_1: R111.1 R121.2 ; port PHY_RXER
NetR111_2: R111.2 U17.20(RXER/ISO)
NetR112_1: R112.1 R122.2 ; port PHY_RX_DV
NetR112_2: R112.2 U17.18(RXDV/CONFIG2)
NetR114_1: R114.1 R123.2 ; port PHY_CRS
NetR114_2: R114.2 U17.29(CRS/CONFIG1)
NetR115_1: R115.1 R124.2 ; port PHY_COL
NetR115_2: R115.2 U17.28(COL/CONFIG0)
NetU1_16: U17.12(MDC) ; port PHY_MDC
NetU1_70: U16.4(RXD) ; port CAN_RX
NetU1_71: U16.1(TXD) ; port CAN_TX

### Notes on the sheet
- Soft Reset
- Title
- Size:
- Date:
- A3
- Number:
- Time:
- Revision:
- Sheet
- of
- File:

### Library data of the parts
C74 C75 C77 C79 C81 = CL10B104KA8WPNC: as C9 on sheet Interfaces; Part Number: CL10B104KA8WPNC; Value: 0.1µF; Applications: Automotive; Capacitance: 0.1µF; ComponentLink1Description: Datasheet; ComponentLink1URL: http://www.samsungsem.com/kr/support/product-search/mlcc/CL10B104KA8WPNC.jsp; ComponentLink2Description: DigiKey Link; ComponentLink2URL: http://digikey.com/product-detail/en/samsung-electro-mechanics/CL10B104KA8WPNC/1276-6717-1-ND/5961576; Device Package: 0603 (1608 Metric); Features: Open Mode; LastUpdated: 9/2/2020 1:03:30 AM; Lifecycle Status: Active; Minimum Order: 1; Mounting Type: Surface Mount, MLCC; Operating Temperature: -55°C ~ 125°C; Package / Case: 0603 (1608 Metric); Packaging: TapeAndReel; PartId: 5631; Part Status: Active; Price: 0.02; Ratings: AEC-Q200; Series: CL; Size / Dimension: 0.063" L x 0.031" W (1.60mm x 0.80mm); Supplier 1: DigiKey; Supplier Part Number 1: 1276-6717-1-ND; Temperature Coefficient: X7R; Thickness (Max): 0.035" (0.90mm); Voltage - Rated: 25V
C76 = CL21A225KPFNNNE: CAP CER 2.2UF 10V X5R 0805; Manufacturer: Samsung Electro-Mechanics; Tolerance: ±10%; Part Number: CL21A225KPFNNNE; Value: 2.2µF; Applications: General Purpose; Capacitance: 2.2µF; ComponentLink1Description: Datasheet; ComponentLink1URL: http://www.samsungsem.com/kr/support/product-search/mlcc/CL21A225KPFNNNE.jsp; ComponentLink2Description: DigiKey Link; ComponentLink2URL: http://digikey.com/product-detail/en/samsung-electro-mechanics/CL21A225KPFNNNE/1276-2902-1-ND/3890988; Device Package: 0805 (2012 Metric); LastUpdated: 9/2/2020 1:04:25 AM; Lifecycle Status: Active; Minimum Order: 1; Mounting Type: Surface Mount, MLCC; Operating Temperature: -55°C ~ 85°C; Package / Case: 0805 (2012 Metric); Packaging: TapeAndReel; PartId: 11848; Part Status: Active; Price: 0.03; Series: CL; Size / Dimension: 0.079" L x 0.049" W (2.00mm x 1.25mm); Supplier 1: DigiKey; Supplier Part Number 1: 1276-2902-1-ND; Temperature Coefficient: X5R; Thickness (Max): 0.053" (1.35mm); Voltage - Rated: 10V
C78 C80 = CL21A226KPCLRNC: CAP CER 22UF 10V X5R 0805; Manufacturer: Samsung Electro-Mechanics; Tolerance: ±10%; Part Number: CL21A226KPCLRNC; Value: 22µF; Applications: General Purpose; Capacitance: 22µF; ComponentLink1Description: Datasheet; ComponentLink1URL: http://www.samsungsem.com/kr/support/product-search/mlcc/CL21A226KPCLRNC.jsp; ComponentLink2Description: DigiKey Link; ComponentLink2URL: http://digikey.com/product-detail/en/samsung-electro-mechanics/CL21A226KPCLRNC/1276-6786-1-ND/5961645; Device Package: 0805 (2012 Metric); Features: Low Profile; LastUpdated: 9/2/2020 1:04:38 AM; Lifecycle Status: Active; Minimum Order: 1; Mounting Type: Surface Mount, MLCC; Operating Temperature: -55°C ~ 85°C; Package / Case: 0805 (2012 Metric); Packaging: TapeAndReel; PartId: 4833; Part Status: Active; Price: 0.08; Series: CL; Size / Dimension: 0.079" L x 0.049" W (2.00mm x 1.25mm); Supplier 1: DigiKey; Supplier Part Number 1: 1276-6786-1-ND; Temperature Coefficient: X5R; Thickness (Max): 0.037" (0.95mm); Voltage - Rated: 10V
C82 C83 = CL10C240JB8NNNC: CAP CER 24PF 50V C0G/NP0 0603; Manufacturer: Samsung Electro-Mechanics; Temperature Coefficient: C0G, NP0; Tolerance: ±5%; Part Number: CL10C240JB8NNNC; Value: 24pF; Applications: General Purpose; Capacitance: 24pF; ComponentLink1Description: Datasheet; ComponentLink1URL: http://www.samsungsem.com/kr/support/product-search/mlcc/CL10C240JB8NNNC.jsp; ComponentLink2Description: DigiKey Link; ComponentLink2URL: http://digikey.com/product-detail/en/samsung-electro-mechanics/CL10C240JB8NNNC/1276-1761-1-ND/3889847; Device Package: 0603 (1608 Metric); LastUpdated: 9/2/2020 1:03:22 AM; Lifecycle Status: Active; Minimum Order: 1; Mounting Type: Surface Mount, MLCC; Operating Temperature: -55°C ~ 125°C; Package / Case: 0603 (1608 Metric); Packaging: TapeAndReel; PartId: 10003; Part Status: Active; Price: 0.01; Series: CL; Size / Dimension: 0.063" L x 0.031" W (1.60mm x 0.80mm); Supplier 1: DigiKey; Supplier Part Number 1: 1276-1761-1-ND; Thickness (Max): 0.035" (0.90mm); Voltage - Rated: 50V
C84 = CC0805KKX5R7BB106: as C2 on sheet Interfaces; Part Number: CC0805KKX5R7BB106; Value: 10µF; Applications: General Purpose; Capacitance: 10µF; ComponentLink1Description: Datasheet; ComponentLink1URL: https://www.yageo.com/upload/media/product/productsearch/datasheet/mlcc/UPY-GPHC_X5R_4V-to-50V_25.pdf; ComponentLink2Description: DigiKey Link; ComponentLink2URL: http://digikey.com/product-detail/en/yageo/CC0805KKX5R7BB106/311-1865-1-ND/5195767; Device Package: 0805 (2012 Metric); LastUpdated: 9/2/2020 1:04:30 AM; Lifecycle Status: Active; Minimum Order: 1; Mounting Type: Surface Mount, MLCC; Operating Temperature: -55°C ~ 85°C; Package / Case: 0805 (2012 Metric); Packaging: TapeAndReel; PartId: 8867; Part Status: Active; Price: 0.09; Series: CC; Size / Dimension: 0.079" L x 0.049" W (2.00mm x 1.25mm); Supplier 1: DigiKey; Supplier Part Number 1: 311-1865-1-ND; Temperature Coefficient: X5R; Thickness (Max): 0.057" (1.45mm); Voltage - Rated: 16V
D4 = CMP-14436-000006-1: TVS DIODE 24V 50V SC70-3
D5 D6 = LTST-C193KGKT-5A: as D2 on sheet Interfaces; Part Number: LTST-C193KGKT-5A; Color: Green; ComponentLink1Description: Datasheet; ComponentLink1URL: http://optoelectronics.liteon.com/upload/download/DS22-2007-0094/LTST-C193KGKT-5A.PDF; ComponentLink2Description: DigiKey Link; ComponentLink2URL: http://digikey.com/product-detail/en/lite-on-inc/LTST-C193KGKT-5A/160-1828-1-ND/2356247; Device Package: 0603 (1608 Metric); Height (Max): 0.45mm; LastUpdated: 9/2/2020 1:20:41 AM; Lens Transparency: Clear; Lifecycle Status: Active; Minimum Order: 1; Mounting Type: Surface Mount; Package / Case: 0603 (1608 Metric); Packaging: TapeAndReel; PartId: 694; Part Status: Active; Price: 0.06; Series: -; Size / Dimension: 1.60mm L x 0.80mm W; Supplier 1: DigiKey; Supplier Part Number 1: 160-1828-1-ND; Supplier Device Package: Chip LED; Value: Green
D7 = 1N4148W RHG: DIODE GEN PURP 100V 150MA SOD123; Manufacturer: Taiwan Semiconductor Corporation; Current - Average Rectified (Io): 150mA (DC); Current - Reverse Leakage @ Vr: 5µA @ 75V; Diode Type: Standard; Reverse Recovery Time (trr): 4ns; Speed: Fast Recovery =< 500ns, > 200mA (Io); Voltage - Forward (Vf) (Max) @ If: 1V @ 100mA; Part Number: 1N4148W RHG; ComponentLink1Description: Datasheet; ComponentLink1URL: https://www.taiwansemi.com/products/datasheet/1N4148W%20SERIES_K1804.pdf; ComponentLink2Description: DigiKey Link; ComponentLink2URL: http://digikey.com/product-detail/en/taiwan-semiconductor-corporation/1N4148W-RHG/1N4148WRHGCT-ND/7357066; LastUpdated: 9/2/2020 1:19:10 AM; Lifecycle Status: Active; Minimum Order: 1; Mounting Type: Surface Mount; Operating Temperature - Junction: -65°C ~ 150°C; Package / Case: SOD-123F; Packaging: TapeAndReel; PartId: 1073; Part Status: Active; Price: 0.03; Series: -; Supplier 1: DigiKey; Supplier Part Number 1: 1N4148WRHGCT-ND; Supplier Device Package: SOD-123F; Voltage - DC Reverse (Vr) (Max): 100V
R91 = RMCF0603FG100R: RES 100 OHM 1% 1/10W 0603; Manufacturer: Stackpole Electronics Inc; Power (Watts): 0.1W, 1/10W; Temperature Coefficient: ±100ppm/°C; Part Number: RMCF0603FG100R; Value: 100 Ohms; ComponentLink1Description: Datasheet; ComponentLink1URL: https://www.seielect.com/catalog/sei-rmcf_rmcp.pdf; ComponentLink2Description: DigiKey Link; ComponentLink2URL: http://digikey.com/product-detail/en/stackpole-electronics-inc/RMCF0603FG100R/RMCF0603FG100RCT-ND/4425033; Composition: Thick Film; Device Package: 0603 (1608 Metric); Features: Automotive AEC-Q200; Height - Seated (Max): 0.022" (0.55mm); LastUpdated: 9/2/2020 1:09:39 AM; Lifecycle Status: Active; Minimum Order: 1; Number of Terminations: 2; Operating Temperature: -55°C ~ 155°C; Package / Case: 0603 (1608 Metric); Packaging: CutTape; PartId: 24036; Part Status: Active; Price: 0.10; Ratings: AEC-Q200; Resistance: 100 Ohms; Series: RMCF; Size / Dimension: 0.061" L x 0.031" W (1.55mm x 0.80mm); Supplier 1: DigiKey; Supplier Part Number 1: RMCF0603FG100RCT-ND; Supplier Device Package: 0603; Tolerance: ±1%
R92 R93 R113 R120 = RMCF0603JT10K0: as R2 on sheet Interfaces; Part Number: RMCF0603JT10K0; Value: 10 kOhms; ComponentLink1Description: Datasheet; ComponentLink1URL: https://www.seielect.com/catalog/sei-packaging.pdf; ComponentLink2Description: DigiKey Link; ComponentLink2URL: http://digikey.com/product-detail/en/stackpole-electronics-inc/RMCF0603JT10K0/RMCF0603JT10K0CT-ND/1943191; Composition: Thick Film; Device Package: 0603 (1608 Metric); Features: Automotive AEC-Q200; Height - Seated (Max): 0.022" (0.55mm); LastUpdated: 8/30/2020 8:48:45 PM; Lifecycle Status: Active; Minimum Order: 1; Number of Terminations: 2; Operating Temperature: -55°C ~ 155°C; Package / Case: 0603 (1608 Metric); Packaging: CutTape; PartId: 25659; Part Status: Active; Price: 0.10; Ratings: AEC-Q200; Resistance: 10 kOhms; Series: RMCF; Size / Dimension: 0.061" L x 0.031" W (1.55mm x 0.80mm); Supplier 1: DigiKey; Supplier Part Number 1: RMCF0603JT10K0CT-ND; Supplier Device Package: 0603; Tolerance: ±5%
R94 R95 R110 R116-R119 R121-R124 = RNCP0603FTD1K00: RES 1K OHM 1% 1/8W 0603; Manufacturer: Stackpole Electronics Inc; Power (Watts): 0.125W, 1/8W; Temperature Coefficient: ±100ppm/°C; Part Number: RNCP0603FTD1K00; Value: 1 kOhms; ComponentLink1Description: Datasheet; ComponentLink1URL: https://www.seielect.com/catalog/sei-rncp.pdf; ComponentLink2Description: DigiKey Link; ComponentLink2URL: http://digikey.com/product-detail/en/stackpole-electronics-inc/RNCP0603FTD1K00/RNCP0603FTD1K00CT-ND/2240445; Composition: Thin Film; Device Package: 0603 (1608 Metric); Features: Anti-Sulfur, Moisture Resistant; Height - Seated (Max): 0.020" (0.50mm); LastUpdated: 9/2/2020 1:10:23 AM; Lifecycle Status: Active; Minimum Order: 1; Number of Terminations: 2; Operating Temperature: -55°C ~ 155°C; Package / Case: 0603 (1608 Metric); Packaging: TapeAndReel; PartId: 5694; Part Status: Active; Price: 0.01; Resistance: 1 kOhms; Series: RNCP; Size / Dimension: 0.059" L x 0.031" W (1.50mm x 0.80mm); Supplier 1: DigiKey; Supplier Part Number 1: RNCP0603FTD1K00CT-ND; Supplier Device Package: 0603; Tolerance: ±1%
R96 R97 = RMCF0603JT240R: RES 240 OHM 5% 1/10W 0603; Manufacturer: Stackpole Electronics Inc; Power (Watts): 0.1W, 1/10W; Temperature Coefficient: ±200ppm/°C; Part Number: RMCF0603JT240R; Value: 240 Ohms; ComponentLink1Description: Datasheet; ComponentLink1URL: https://www.seielect.com/catalog/sei-rmcf_rmcp.pdf; ComponentLink2Description: DigiKey Link; ComponentLink2URL: http://digikey.com/product-detail/en/stackpole-electronics-inc/RMCF0603JT240R/RMCF0603JT240RCT-ND/2418189; Composition: Thick Film; Device Package: 0603 (1608 Metric); Features: Automotive AEC-Q200; Height - Seated (Max): 0.022" (0.55mm); LastUpdated: 9/2/2020 1:10:22 AM; Lifecycle Status: Active; Minimum Order: 1; Number of Terminations: 2; Operating Temperature: -55°C ~ 155°C; Package / Case: 0603 (1608 Metric); Packaging: CutTape; PartId: 5995; Part Status: Active; Price: 0.10; Ratings: AEC-Q200; Resistance: 240 Ohms; Series: RMCF; Size / Dimension: 0.061" L x 0.031" W (1.55mm x 0.80mm); Supplier 1: DigiKey; Supplier Part Number 1: RMCF0603JT240RCT-ND; Supplier Device Package: 0603; Tolerance: ±5%
R98 R103-R108 R111 R112 R114 R115 = RMCF0603FT22R0: RES 22 OHM 1% 1/10W 0603; Manufacturer: Stackpole Electronics Inc; Power (Watts): 0.1W, 1/10W; Temperature Coefficient: ±100ppm/°C; Part Number: RMCF0603FT22R0; Value: 22 Ohms; ComponentLink1Description: Datasheet; ComponentLink1URL: https://www.seielect.com/catalog/sei-packaging.pdf; ComponentLink2Description: DigiKey Link; ComponentLink2URL: http://digikey.com/product-detail/en/stackpole-electronics-inc/RMCF0603FT22R0/RMCF0603FT22R0CT-ND/1942946; Composition: Thick Film; Device Package: 0603 (1608 Metric); Features: Automotive AEC-Q200; Height - Seated (Max): 0.022" (0.55mm); LastUpdated: 9/2/2020 1:10:13 AM; Lifecycle Status: Active; Minimum Order: 1; Number of Terminations: 2; Operating Temperature: -55°C ~ 155°C; Package / Case: 0603 (1608 Metric); Packaging: CutTape; PartId: 10611; Part Status: Active; Price: 0.10; Ratings: AEC-Q200; Resistance: 22 Ohms; Series: RMCF; Size / Dimension: 0.061" L x 0.031" W (1.55mm x 0.80mm); Supplier 1: DigiKey; Supplier Part Number 1: RMCF0603FT22R0CT-ND; Supplier Device Package: 0603; Tolerance: ±1%
R109 = RNCP0603FTD6K49: RES 6.49K OHM 1% 1/8W 0603; Manufacturer: Stackpole Electronics Inc; Power (Watts): 0.125W, 1/8W; Temperature Coefficient: ±100ppm/°C; Part Number: RNCP0603FTD6K49; Value: 6.49 kOhms; ComponentLink1Description: Datasheet; ComponentLink1URL: https://www.seielect.com/catalog/sei-rncp.pdf; ComponentLink2Description: DigiKey Link; ComponentLink2URL: http://digikey.com/product-detail/en/stackpole-electronics-inc/RNCP0603FTD6K49/RNCP0603FTD6K49CT-ND/2240472; Composition: Thin Film; Device Package: 0603 (1608 Metric); Features: Anti-Sulfur, Moisture Resistant; Height - Seated (Max): 0.020" (0.50mm); LastUpdated: 9/2/2020 1:09:47 AM; Lifecycle Status: Active; Minimum Order: 1; Number of Terminations: 2; Operating Temperature: -55°C ~ 155°C; Package / Case: 0603 (1608 Metric); Packaging: TapeAndReel; PartId: 22308; Part Status: Active; Price: 0.01; Resistance: 6.49 kOhms; Series: RNCP; Size / Dimension: 0.059" L x 0.031" W (1.50mm x 0.80mm); Supplier 1: DigiKey; Supplier Part Number 1: RNCP0603FTD6K49CT-ND; Supplier Device Package: 0603; Tolerance: ±1%
U17 = CMP-06281-000005-1: IC TRANSCEIVER FULL 1/1 32QFN; Manufacturer: Microchip; Max Junction Temp: +125°C; Max Supply Voltage: 3.465V; Min Supply Voltage: 1.71V; Data Rate: 100Mbits/s; Simplex Duplex: Full Duplex; Standoff Height: 0mm; Number Of Channels: 1; Interface: Ethernet,Other; Device Class L2: Interface ICs; Package: QFN55-32LD-PL-5; Octopart: https://octopart.com/ksz8081mnxia-tr-microchip-66799958; Ambient Temperature Range High: +85°C; Device Class L3: Ethernet Interface ICs; Mouser Description: Ethernet ICs 10/100 PHY,  0.11u, I-Temp; Temperature: -40°C to +85°C; Category: IC; Lead Free: Yes; Ambient Temperature Range Low: -40°C; Height: 1mm; ComponentLink2URL: http://ww1.microchip.com/downloads/en/DeviceDoc/00002202C.pdf; Digikey Description: IC TRANSCEIVER FULL 1/1 32QFN; Automotive: No; Device Class L1: Integrated Circuits (ICs); ComponentLink2Description: Datasheet; Temperature Range High: +85°C; Temperature Range Low: -40°C; RoHS: TRUE; Manufacturer Part Number: KSZ8081MNXIA-TR
Y3 = TSX-3225 25.0000MF20P-C0: CRYSTAL 25.0000MHZ 18PF SMD; Manufacturer: EPSON; ESR (Equivalent Series Resistance): 40 Ohms; Frequency Stability: ±20ppm; Frequency Tolerance: ±10ppm; Operating Mode: Fundamental; Part Number: TSX-3225 25.0000MF20P-C0; ComponentLink1Description: Datasheet; ComponentLink1URL: https://support.epson.biz/td/api/doc_check.php?dl=brief_TSX-3225&lang=en; ComponentLink2Description: DigiKey Link; ComponentLink2URL: http://digikey.com/product-detail/en/epson/TSX-3225-25.0000MF20P-C0/SER4212CT-ND/7430967; Frequency: 25MHz; Height - Seated (Max): 0.024" (0.60mm); LastUpdated: 9/2/2020 1:21:54 AM; Lifecycle Status: Active; Load Capacitance: 18pF; Minimum Order: 1; Mounting Type: Surface Mount; Operating Temperature: -20°C ~ 85°C; Package / Case: 4-SMD, No Lead; Packaging: TapeAndReel; PartId: 447; Part Status: Active; Price: 0.18; Series: TSX-3225; Size / Dimension: 0.126" L x 0.098" W (3.20mm x 2.50mm); Supplier 1: DigiKey; Supplier Part Number 1: SER4212CT-ND; Type: MHz Crystal; Value: 25MHz
U16 = SCH - INTERFACE - CAN - TI TCAN1051V: Supplier 1: Digi-Key